# EAGLE schematic schema (EAGLE 7.2.0)
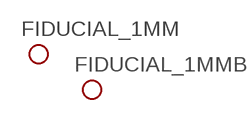
[diagram p0: schematic, sheet 1]

## Parts
FIDUCIAL_1MM  FIDUCIAL_1MM  [FIDUCIAL_1MM]
FIDUCIAL_1MMB  FIDUCIAL_1MM  [FIDUCIAL_1MM]
Unconnected: FIDUCIAL_1MM.1 FIDUCIAL_1MMB.1

## Library data of the parts
FIDUCIAL_1MM FIDUCIAL_1MMB = fiducials:FIDUCIAL_1MM